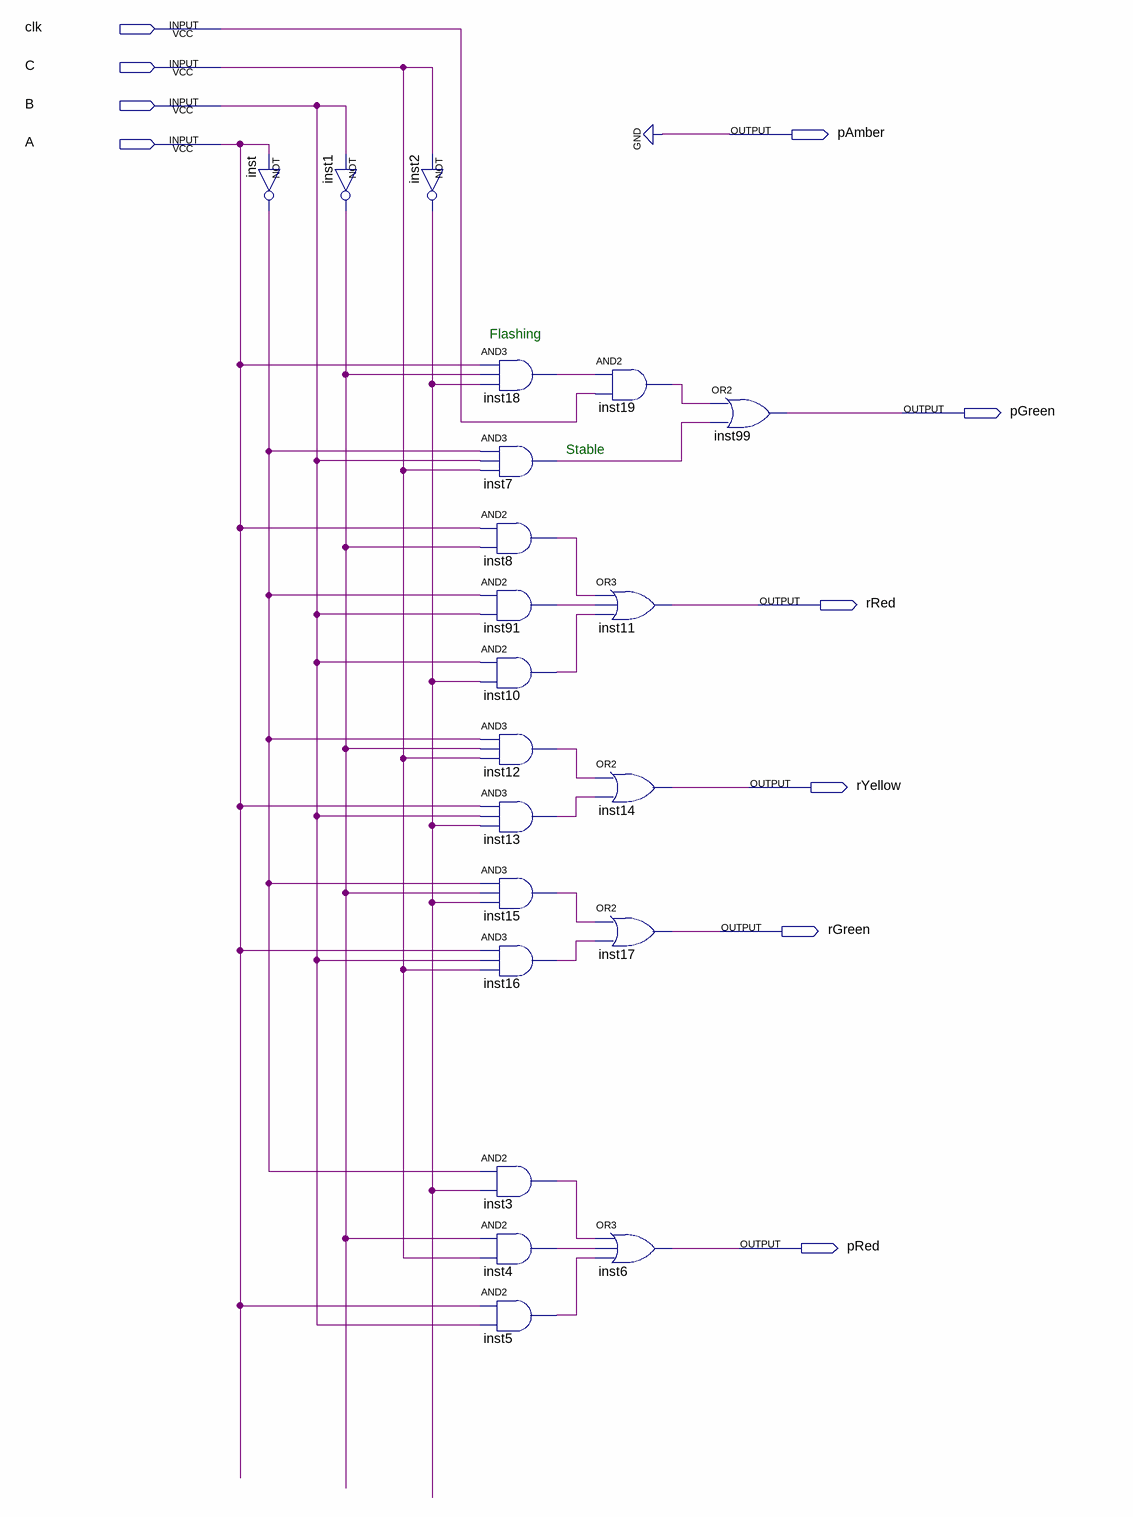
[diagram p0: schematic sheet]
// Quartus schematic TLD.bdf as structural Verilog: 21 symbols, 10 pins
module TLD (
  input  clk,
  input  C,
  input  B,
  input  A,
  output pAmber,
  output pGreen,
  output rRed,
  output rYellow,
  output rGreen,
  output pRed
);

  wire inst1_out, inst2_out, inst3_out, inst4_out, inst5_out, inst7_out, inst8_out, inst10_out, inst12_out,
       inst13_out, inst15_out, inst16_out, inst18_out, inst19_out, inst91_out, inst_out;

  not inst (inst_out, A);
  not inst1 (inst1_out, B);
  not inst2 (inst2_out, C);
  and inst18 (inst18_out, A, inst1_out, inst2_out);
  and inst7 (inst7_out, inst_out, B, C);
  and inst8 (inst8_out, A, inst1_out);
  and inst91 (inst91_out, inst_out, B);
  and inst10 (inst10_out, B, inst2_out);
  and inst12 (inst12_out, inst_out, inst1_out, C);
  and inst13 (inst13_out, A, B, inst2_out);
  and inst15 (inst15_out, inst_out, inst1_out, inst2_out);
  and inst16 (inst16_out, A, B, C);
  and inst3 (inst3_out, inst_out, inst2_out);
  and inst4 (inst4_out, inst1_out, C);
  and inst5 (inst5_out, A, B);
  and inst19 (inst19_out, inst18_out, clk);
  or inst11 (rRed, inst8_out, inst91_out, inst10_out);
  or inst14 (rYellow, inst12_out, inst13_out);
  or inst17 (rGreen, inst15_out, inst16_out);
  or inst6 (pRed, inst3_out, inst4_out, inst5_out);
  or inst99 (pGreen, inst19_out, inst7_out);

  assign pAmber = 1'b0;

  // Notes on the sheet:
  //   Flashing
  //   Stable
endmodule
